# EasyEDA Pro project 电调.eprj

# Schematic Schematic1
Board Name: Board1; Create Date: 2025-06-07; Page Name: P1; Project Name: 电调单通道; Schematic Name: Schematic1; Update Date: 2025-06-07; Company: 嘉立创EDA; Page Size: A4; Version: V1.0
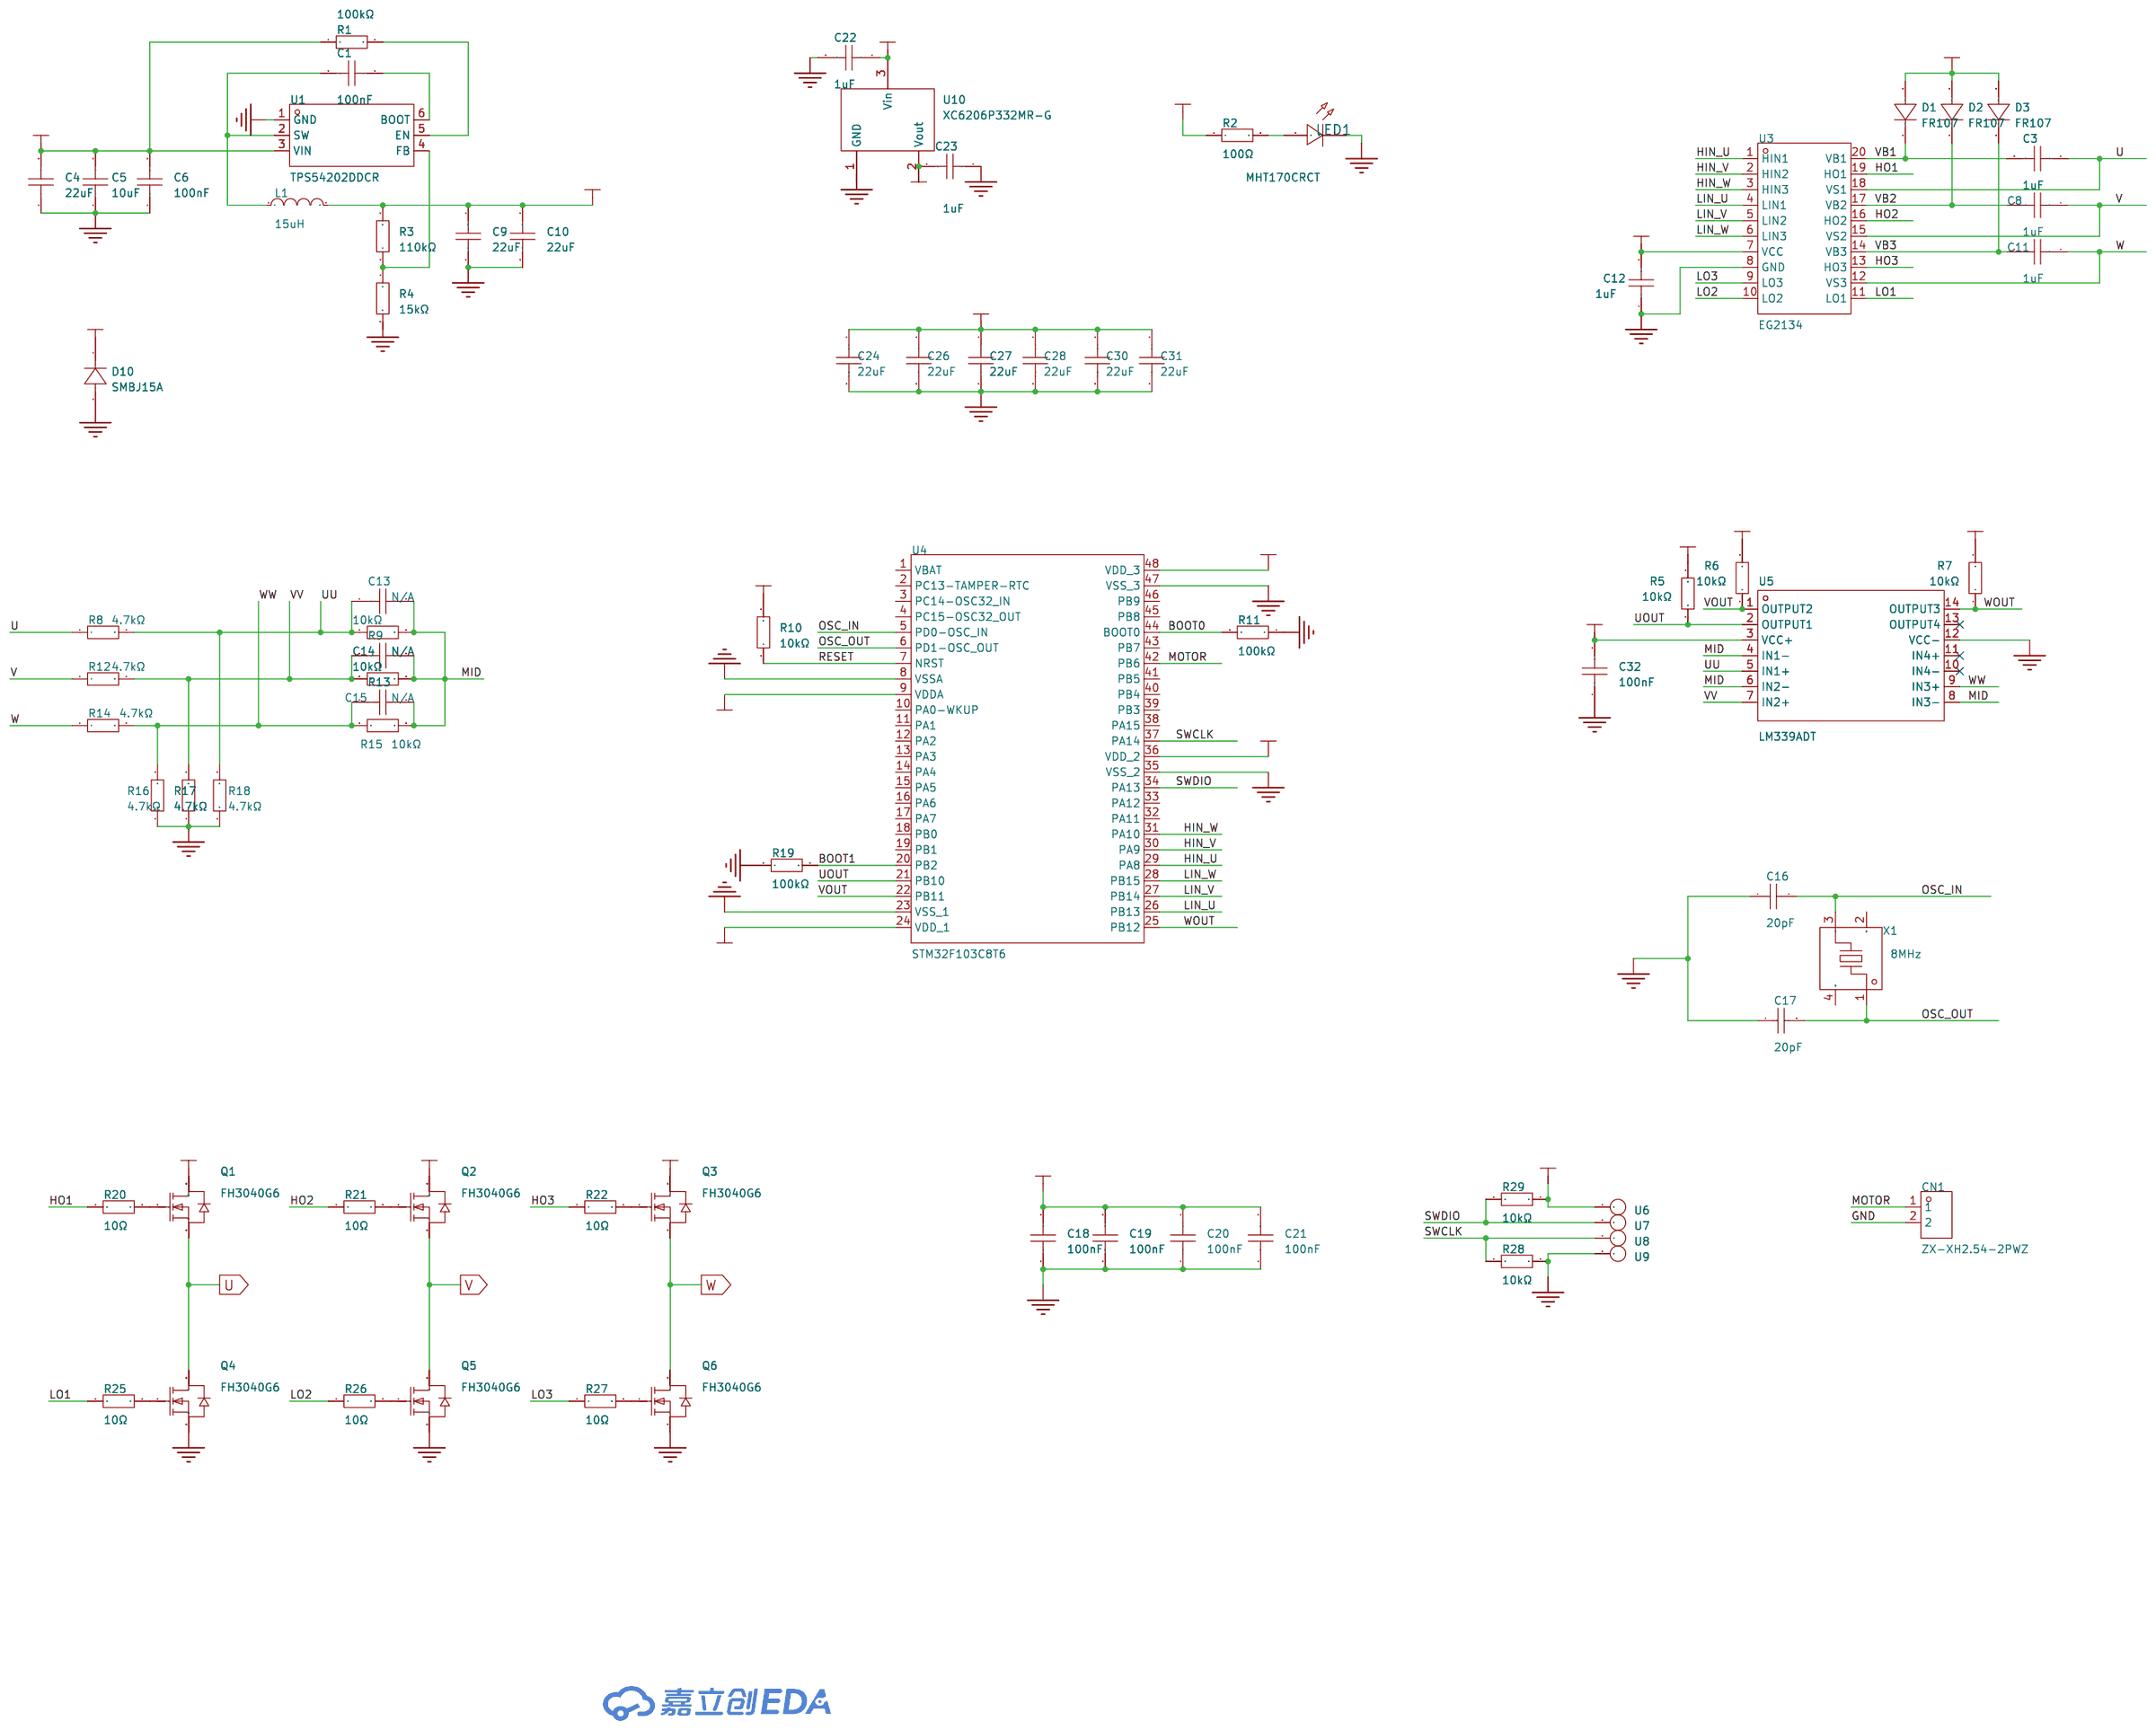
[diagram p0: schematic sheet]

## Parts
C1  100nF  [C0603]
C3  1uF  [C0603]
C4  22uF  [C0805]
C5  10uF  [C0805]
C6  100nF  [C0603]
C8  1uF  [C0603]
C9  22uF  [C0805]
C10  22uF  [C0805]
C11  1uF  [C0603]
C12  1uF  [C0603]
C13  N/A  [C0603]
C14  N/A  [C0603]
C15  N/A  [C0603]
C16  20pF  [C0603]
C17  20pF  [C0603]
C18  100nF  [C0603]
C19  100nF  [C0603]
C20  100nF  [C0603]
C21  100nF  [C0603]
C22  1uF  [C0603]
C23  1uF  [C0603]
C24  22uF  [C0805]
C26  22uF  [C0805]
C27  22uF  [C0805]
C28  22uF  [C0805]
C30  22uF  [C0805]
C31  22uF  [C0805]
C32  100nF  [C0603]
CN1  ZX-XH2.54-2PWZ  [CONN-TH_2P-P2.50_ZX-XH2.54-2PWZ]
D1  FR107  [SOD-123FL_L2.7-W1.8-LS3.8-RD]
D2  FR107  [SOD-123FL_L2.7-W1.8-LS3.8-RD]
D3  FR107  [SOD-123FL_L2.7-W1.8-LS3.8-RD]
D10  SMBJ15A  [SMB_L4.3-W3.6-LS5.3-RD]
L1  15uH  [IND-SMD_L7.0-W6.6_FXL0630]
LED1  MHT170CRCT  [LED0805-RD]
Q1  FH3040G6  [DFN-8_L3.3-W3.0-P0.65-LS3.3-BL-EP]
Q2  FH3040G6  [DFN-8_L3.3-W3.0-P0.65-LS3.3-BL-EP]
Q3  FH3040G6  [DFN-8_L3.3-W3.0-P0.65-LS3.3-BL-EP]
Q4  FH3040G6  [DFN-8_L3.3-W3.0-P0.65-LS3.3-BL-EP]
Q5  FH3040G6  [DFN-8_L3.3-W3.0-P0.65-LS3.3-BL-EP]
Q6  FH3040G6  [DFN-8_L3.3-W3.0-P0.65-LS3.3-BL-EP]
R1  100kΩ  [R0603]
R2  100Ω  [R0603]
R3  110kΩ  [R0603]
R4  15kΩ  [R0603]
R5  10kΩ  [R0603]
R6  10kΩ  [R0603]
R7  10kΩ  [R0603]
R8  4.7kΩ  [R0603]
R9  10kΩ  [R0603]
R10  10kΩ  [R0603]
R11  100kΩ  [R0603]
R12  4.7kΩ  [R0603]
R13  10kΩ  [R0603]
R14  4.7kΩ  [R0603]
R15  10kΩ  [R0603]
R16  4.7kΩ  [R0603]
R17  4.7kΩ  [R0603]
R18  4.7kΩ  [R0603]
R19  100kΩ  [R0603]
R20  10Ω  [R0603]
R21  10Ω  [R0603]
R22  10Ω  [R0603]
R25  10Ω  [R0603]
R26  10Ω  [R0603]
R27  10Ω  [R0603]
R28  10kΩ  [R0603]
R29  10kΩ  [R0603]
U1  TPS54202DDCR  [SOT-23-6_L2.9-W1.6-P0.95-LS2.8-BL]
U3  EG2134  [TSSOP-20_L6.5-W4.4-P0.65-LS6.4-BL]
U4  STM32F103C8T6  [LQFP-48_L7.0-W7.0-P0.50-LS9.0-BL]
U5  LM339ADT  [SOIC-14_L8.7-W3.9-P1.27-LS6.0-BL]
U6  -  [触点]
U7  -  [触点]
U8  -  [触点]
U9  -  [触点]
U10  XC6206P332MR-G  [SOT-23-3_L2.9-W1.6-P1.90-LS2.8-BR]
X1  8MHz  [CRYSTAL-SMD_4P-L3.2-W2.5-BL]

## Library data of the parts
C1 C6 C18-C21 C32 = CGA0603X7R104K500JT: 容值:100nF;精度:±10%;额定电压:50V;温度系数:X7R;; LCSC Part Name: 100nF ±10% 50V; Supplier Part: C6119867; Manufacturer: HRE(芯声); Supplier Footprint: 0603; JLCPCB Part Class: Extended Part; Datasheet: https://atta.szlcsc.com/upload/public/pdf/source/20250103/C44077DA9E7B3EFAE02F22B6D3D1CBC9.pdf; Supplier: LCSC; Tolerance: ±10%; Voltage Rating: 50V; Temperature Coefficient: X7R
C3 C8 C11 C12 C22 C23 = CL10A105KB8NNNC: 容值:1uF;精度:±10%;额定电压:50V;材质(温度系数):X5R;; LCSC Part Name: 1uF ±10% 50V; Supplier Part: C15849; Manufacturer: SAMSUNG(三星); Supplier Footprint: 0603; JLCPCB Part Class: 基础库; Datasheet: https://atta.szlcsc.com/upload/public/pdf/source/20160218/1457707763339.pdf; Supplier: LCSC; Tolerance: ±10%; Voltage Rated: 50V; Temperature Coefficient: X5R
C4 C9 C10 C24 C26-C28 C30 C31 = CL21A226MAYNNNE: 容值:22uF;精度:±20%;额定电压:25V;材质(温度系数):X5R;; LCSC Part Name: 22uF ±20% 25V; Supplier Part: C602037; Manufacturer: SAMSUNG(三星); Supplier Footprint: 0805; JLCPCB Part Class: 扩展库; Datasheet: https://atta.szlcsc.com/upload/public/pdf/source/20200609/C602037_1A0D619693E608A1BF6E80154254E2DB.pdf; Supplier: LCSC; Tolerance: ±20%; Voltage Rated: 25V; Temperature Coefficient: X5R
C5 = CL21A106KAYNNNE_C15850: 容值:10uF;精度:±10%;额定电压:25V;材质(温度系数):X5R;; LCSC Part Name: 10uF ±10% 25V; Supplier Part: C15850; Manufacturer: SAMSUNG(三星); Manufacturer Part: CL21A106KAYNNNE; Supplier Footprint: 0805; JLCPCB Part Class: 基础库; Datasheet: https://atta.szlcsc.com/upload/public/pdf/source/20160218/1457707763339.pdf; Supplier: LCSC; Tolerance: ±10%; Voltage Rated: 25V; Temperature Coefficient: X5R
C13-C15 = CAP_0603: Supplier Footprint: 0603
C16 C17 = CC0603JRNPO9BN200: 容值:20pF;精度:±5%;额定电压:50V;材质(温度系数):NP0;; LCSC Part Name: 20pF ±5% 50V; Supplier Part: C105621; Manufacturer: YAGEO(国巨); Supplier Footprint: 0603; JLCPCB Part Class: 扩展库; Datasheet: https://atta.szlcsc.com/upload/public/pdf/source/20170505/1493957838062.pdf; Supplier: LCSC; Tolerance: ±5%; Voltage Rated: 50V; Temperature Coefficient: NP0
CN1 = ZX-XH2.54-2PWZ: 插针结构:1x2P;间距:2.5mm;安装方式:弯插;参考系列:XH;总PIN数:2P;排数:1;每排PIN数:2;行距:-;额定电流:3A;触头材质:黄铜;触头镀层:锡;工作温度范围:-25℃~+85℃;; LCSC Part Name: 1x2P 间距:2.5mm 弯插 系列:XH; Supplier Part: C7429641; Manufacturer: Megastar(兆星); Supplier Footprint: 弯插,P=2.5mm; JLCPCB Part Class: 扩展库; Datasheet: https://atta.szlcsc.com/upload/public/pdf/source/20230619/56AE8F2E01CDFEAA97FC89B5ED558AB5.pdf; Supplier: LCSC; Pins Structure: 1x2P; Pitch: 2.5mm; Mounting Type: 弯插; Reference Series: XH; Number of Pins: 2P; Number of Rows: 1; Number of PINs Per Row: 2; Rated Current: 3A; Contact Material: 黄铜; Contact Plating: 锡; Operating Temperature: -25℃~+85℃; Rated Voltage (Max): 250V; Plastic Material: PA66; Flame Retardant Rating: UL94V-0; Color: 白色; Z-Height of the Board: 5.9mm; X-Length of Bottom Edge on Board (Spacing Line): 7.5mm; Y-Width of Bottom Edge on Board: 7.32mm
D1-D3 = FR107_C2760867: 二极管配置:独立式;正向压降(Vf):1.3V@1A;直流反向耐压(Vr):1kV;整流电流:1A;反向恢复时间(trr):500ns;; Supplier Part: C2760867; Manufacturer: Slkor(萨科微); Supplier Footprint: SOD-123FL; JLCPCB Part Class: 扩展库; Datasheet: https://atta.szlcsc.com/upload/public/pdf/source/20210316/C2760867_0B45AFF5F62837EEEC945A80EBBE02AA.pdf; Supplier: LCSC; Diode Configuration: 独立式; Forward Voltage (Vf@If): 1.3V@1A; Reverse Voltage (Vr): 1kV; Rectified Current: 1A; Reverse Leakage Current (Ir): 5uA@1kV; Reverse Recovery Time (trr): 500ns; Operating Temperature: -55℃~+150℃@(Tj)
D10 = SMBJ15A_C19077569: 极性:单向;反向截止电压(Vrwm):15V;钳位电压:24.4V;峰值脉冲电流(Ipp):24.59A;峰值脉冲功率(Ppp):600W;击穿电压:18.5V;; Supplier Part: C19077569; Manufacturer: 宏嘉诚; Supplier Footprint: SMB; JLCPCB Part Class: 扩展库; Datasheet: https://atta.szlcsc.com/upload/public/pdf/source/20250107/474F05451FC8AB27D7FA0238914F96F6.pdf; Supplier: LCSC; Polarity: 单向; Reverse Stand-Off Voltage (Vrwm): 15V; Clamping Voltage: 24.4V; Peak Pulse Current (Ipp): 24.59A; Peak Pulse Power Dissipation (Ppp): 600W; Voltage - Breakdown: 18.5V; Reverse Leakage Current (Ir): 5uA; Type: TVS
L1 = FXL0630-150-M: 电感值:15uH;精度:±20%;额定电流:3A;饱和电流(Isat):4.5A;类型:一体成型电感;; LCSC Part Name: 15uH ±20% 4.5A; Supplier Part: C177243; Manufacturer: cjiang(长江微电); Supplier Footprint: SMD,6.6x7mm; JLCPCB Part Class: 扩展库; Datasheet: https://atta.szlcsc.com/upload/public/pdf/source/20240426/3189EA8206330E2108542F9E34E540E7.pdf; Supplier: LCSC; Tolerance: ±20%; Rated Current: 3A; Saturation Current (Isat): 4.5A; DC Resistance (DCR): 115mΩ; Type: 一体成型电感
LED1 = MHT170CRCT: 发光颜色:红色;功率:60mW；40mW;正向电流:20mA;主波长:617.5nm~633.5nm;二极管配置:-;透镜颜色:无色透明透镜;色温:-;发光角度:140°;载带方式:-;工作温度:-40℃~+85℃;; LCSC Part Name: 红灯; Supplier Part: C389523; Manufacturer: MEIHUA(美华); Supplier Footprint: 0805; JLCPCB Part Class: Extended Part; Datasheet: https://atta.szlcsc.com/upload/public/pdf/source/20190515/C389523_83CDF1F865E0603B87BA4637FE3B16EE.pdf; Supplier: LCSC; Emitted Color: 红色; Power Dissipation: 60mW；40mW; Forward Current: 20mA; Dominant Wavelength: 617.5nm~633.5nm; Peak Wavelength: 632nm; Lens Color: 无色透明透镜; Viewing Angle: 140°; Operating Temperature: -40℃~+85℃
Q1-Q6 = FH3040G6: 类型:1个N沟道;漏源电压(Vdss):30V;连续漏极电流(Id):40A;导通电阻(RDS(on)):-;耗散功率(Pd):35W;阈值电压(Vgs(th)):1.6V;; LCSC Part Name: N沟道增强型功率MOSFET,电流:40A,耐压:30V; Supplier Part: C2929017; Manufacturer: 鑫飞宏; Supplier Footprint: DFN-8-EP(3.3x3.3); JLCPCB Part Class: 扩展库; Datasheet: https://atta.szlcsc.com/upload/public/pdf/source/20211207/E98152BD916620F113CB2D51F2AAD46A.pdf; Supplier: LCSC; Type: 1个N沟道; Drain to Source Voltage: 30V; Current - Continuous Drain(Id): 40A; Pd - Power Dissipation: 35W; Gate Threshold Voltage (Vgs(th)@Id): 1.6V; Gate Charge(Qg): 45nC@10V; Input Capacitance(Ciss@Vds): 2.33nF@15V; Reverse Transfer Capacitance (Crss@Vds): 230pF@15V; Operating Temperature: -55℃~+150℃
R1 R11 R19 = RT0603BRD07100KL: 电阻类型:薄膜电阻;阻值:100kΩ;精度:±0.1%;功率:100mW;最大工作电压:75V;温度系数:±25ppm/℃;; LCSC Part Name: 薄膜电阻 100kΩ ±0.1% 100mW; Supplier Part: C122538; Manufacturer: YAGEO(国巨); Supplier Footprint: 0603; JLCPCB Part Class: Extended Part; Datasheet: https://atta.szlcsc.com/upload/public/pdf/source/20170721/C122538_1500619326323834092.pdf; Supplier: LCSC; Type: 薄膜电阻; Tolerance: ±0.1%; Power(Watts): 100mW; Overload Voltage (Max): 75V; Temperature Coefficient: ±25ppm/℃; Operating Temperature Range: -55℃~+155℃
R2 = RC0603FR-07100RL: 电阻类型:厚膜电阻;阻值:100Ω;精度:±1%;功率:100mW;最大工作电压:75V;温度系数:±100ppm/℃;; LCSC Part Name: 厚膜电阻 100Ω ±1% 100mW; Supplier Part: C105588; Manufacturer: YAGEO(国巨); Supplier Footprint: 0603; JLCPCB Part Class: Extended Part; Datasheet: https://atta.szlcsc.com/upload/public/pdf/source/20180316/70C0E2BDAE7FCC62C531A5A58D202EE1.pdf; Supplier: LCSC; Type: 厚膜电阻; Tolerance: ±1%; Power(Watts): 100mW; Overload Voltage (Max): 75V; Temperature Coefficient: ±100ppm/℃; Operating Temperature Range: -55℃~+155℃
R3 = RC0603FR-07110KL: 电阻类型:厚膜电阻;阻值:110kΩ;精度:±1%;功率:100mW;最大工作电压:75V;温度系数:±100ppm/℃;; LCSC Part Name: 厚膜电阻 110kΩ ±1% 100mW; Supplier Part: C137807; Manufacturer: YAGEO(国巨); Supplier Footprint: 0603; JLCPCB Part Class: 扩展库; Datasheet: https://atta.szlcsc.com/upload/public/pdf/source/20180821/C275644_0D56F95EFF785E7D9A1FEF436B37DA78.pdf; Supplier: LCSC; Type: 厚膜电阻; Tolerance: ±1%; Power(Watts): 100mW; Overload Voltage (Max): 75V; Temperature Coefficient: ±100ppm/℃; Operating Temperature Range: -55℃~+155℃
R4 = RC0603FR-0715KL: 电阻类型:厚膜电阻;阻值:15kΩ;精度:±1%;功率:100mW;最大工作电压:75V;温度系数:±100ppm/℃;; LCSC Part Name: 厚膜电阻 15kΩ ±1% 100mW; Supplier Part: C114661; Manufacturer: YAGEO(国巨); Supplier Footprint: 0603; JLCPCB Part Class: 扩展库; Datasheet: https://atta.szlcsc.com/upload/public/pdf/source/20180821/C275644_0D56F95EFF785E7D9A1FEF436B37DA78.pdf; Supplier: LCSC; Type: 厚膜电阻; Tolerance: ±1%; Power(Watts): 100mW; Overload Voltage (Max): 75V; Temperature Coefficient: ±100ppm/℃; Operating Temperature Range: -55℃~+155℃
R5-R7 R9 R10 R13 R15 R28 R29 = 0603WAF1002T5E: 电阻类型:厚膜电阻;阻值:10kΩ;精度:±1%;功率:100mW;最大工作电压:75V;温度系数:±100ppm/℃;; LCSC Part Name: 厚膜电阻 10kΩ ±1% 100mW; Supplier Part: C25804; Manufacturer: UNI-ROYAL(厚声); Supplier Footprint: 0603; JLCPCB Part Class: Basic Part; Datasheet: https://atta.szlcsc.com/upload/public/pdf/source/20200306/C422600_1E6D84923E4A46A82E41ADD87F860B5C.pdf; Supplier: LCSC; Type: 厚膜电阻; Tolerance: ±1%; Power(Watts): 100mW; Overload Voltage (Max): 75V; Temperature Coefficient: ±100ppm/℃; Operating Temperature Range: -55℃~+155℃
R8 R12 R14 R16-R18 = 0603WAF4701T5E: 电阻类型:厚膜电阻;阻值:4.7kΩ;精度:±1%;功率:100mW;最大工作电压:75V;温度系数:±100ppm/℃;; LCSC Part Name: 4.7kΩ ±1% 100mW 厚膜电阻; Supplier Part: C23162; Manufacturer: UNI-ROYAL(厚声); Supplier Footprint: 0603; JLCPCB Part Class: Basic Part; Datasheet: https://atta.szlcsc.com/upload/public/pdf/source/20200306/C422600_1E6D84923E4A46A82E41ADD87F860B5C.pdf; Supplier: LCSC; Type: 厚膜电阻; Tolerance: ±1%; Power(Watts): 100mW; Overload Voltage (Max): 75V; Temperature Coefficient: ±100ppm/℃; Operating Temperature Range: -55℃~+155℃
R20-R22 R25-R27 = RC0603FR-0710RL: 电阻类型:厚膜电阻;阻值:10Ω;精度:±1%;功率:100mW;最大工作电压:75V;温度系数:±200ppm/℃;; LCSC Part Name: 厚膜电阻 10Ω ±1% 100mW; Supplier Part: C109318; Manufacturer: YAGEO(国巨); Supplier Footprint: 0603; JLCPCB Part Class: Extended Part; Datasheet: https://atta.szlcsc.com/upload/public/pdf/source/20180316/70C0E2BDAE7FCC62C531A5A58D202EE1.pdf; Supplier: LCSC; Type: 厚膜电阻; Tolerance: ±1%; Power(Watts): 100mW; Overload Voltage (Max): 75V; Temperature Coefficient: ±200ppm/℃; Operating Temperature Range: -55℃~+155℃
U1 = TPS54202DDCR: 功能类型:降压型;输出类型:可调;工作电压:4.5V~28V;输出电压:-;输出电流:2A;; LCSC Part Name: 4.5V至28V输入、2A输出、低EMI同步降压转换器; Supplier Part: C191884; Manufacturer: TI(德州仪器); Supplier Footprint: SOT-23-6; JLCPCB Part Class: 扩展库; Datasheet: https://www.ti.com/cn/lit/gpn/tps54202; Supplier: LCSC; Function: 降压型; Output Type: 可调; Input Voltage: 4.5V~28V; Output Current: 2A; Switching Frequency: 500kHz; Operating Temperature: -40℃~+125℃; Synchronous Rectification: 是; Number of Outputs: 1; Topology: 降压式; Quiescent Current (Iq): 45uA; Switch tube (built-in/external): 内置
U3 = EG2134: Supplier Part: C480661; Manufacturer: EG(屹晶微); Supplier Footprint: TSSOP-20; JLCPCB Part Class: 扩展库; Datasheet: https://atta.szlcsc.com/upload/public/pdf/source/20200107/C480661_235F21EC73D073F149882C12A613FF28.pdf; Supplier: LCSC
U4 = STM32F103C8T6: CPU内核:ARM-M3;CPU最大主频:72MHz;应用领域:-;; LCSC Part Name: 主流增强型ARM Cortex-M3 MCU，具有64 KB Flash、72 MHz CPU、电机控制、USB和CAN; Supplier Part: C8734; Manufacturer: ST(意法半导体); Supplier Footprint: LQFP-48(7x7); JLCPCB Part Class: 扩展库; Datasheet: https://atta.szlcsc.com/upload/public/pdf/source/20220812/8363ACEC51AD55ECEB84799464F7CB85.pdf; Supplier: LCSC; CPU Core: ARM-M3; CPU Maximum Speed: 72MHz; Program Storage Size: 64KB; Program Memory Type: FLASH; Number of I/O: 37; ADC (Bit): 12bit; Low Voltage Detection Threshold: 2V~3.6V; Check: true
U5 = LM339ADT: 输入失调电压(Vos):2mV;输入偏置电流(Ib):100nA;; LCSC Part Name: 低功耗四通道电压比较器; Supplier Part: C89046; Manufacturer: ST(意法半导体); Supplier Footprint: SOIC-14; JLCPCB Part Class: 扩展库; Datasheet: https://atta.szlcsc.com/upload/public/pdf/source/20181030/C283323_01965803D03C52B8D5D374D61EEFE444.pdf; Supplier: LCSC; Input Offset Voltage (Vos): 2mV; Input Bias Current (Ib): 100nA; Supply Voltage: 2V~32V；1V~16V; Output Type: 开集; Output Mode: MOS；DTL；TTL；CMOS；ECL; Supply Current: 2.5mA; Operating Temperature: 0℃~+70℃
U6-U9 = 触点
U10 = XC6206P332MR-G_C5446: 输出类型:固定;最大输入电压:6V;输出电压:3.3V;最大输出电流:200mA;电源纹波抑制比(PSRR):-;输出极性:正极;; LCSC Part Name: 输入6V 输出3.3V 200mA; Supplier Part: C5446; Manufacturer: TOREX(特瑞仕); Supplier Footprint: SOT-23-3L; JLCPCB Part Class: 基础库; Datasheet: https://atta.szlcsc.com/upload/public/pdf/source/20130823/1457706639850.pdf; Supplier: LCSC; Output Type: 固定; Maximum Input Voltage: 6V; Output Voltage: 3.3V; MAX Output Current: 200mA; Dropout Voltage: 680mV@(100mA); Output Polarity: 正极; Number of Outputs: 1
X1 = X32258MSB4SI: 晶振类型:贴片晶振;频率:8MHz;常温频差:±10ppm;负载电容:20pF;频率稳定度:±20ppm;; LCSC Part Name: 8MHz ±10ppm 20pF; Supplier Part: C2682774; Manufacturer: YXC(扬兴晶振); Supplier Footprint: SMD3225-4P; JLCPCB Part Class: 扩展库; Datasheet: https://atta.szlcsc.com/upload/public/pdf/source/20240329/19D5F850207469550BEB00D7DFEDBC7A.pdf; Supplier: LCSC; Type: 贴片晶振; Normal temperature Frequency Tolerance: ±10ppm; Load Capacitance: 20pF; Frequency Stability: ±20ppm; Operating Temperature: -40℃~+85℃

## Nets
GND: C4.1 C5.1 C6.1 C9.2 C10.2 C12.1 C16.1 C17.1 C18.1 C19.1 C20.1 C21.1 C22.2 C23.1 C24.2 C26.2 C27.2 C28.2 C30.2 C31.2 C32.1 CN1.2 D10.2(A) LED1.1(C) Q4.1(S) Q4.2(S) Q4.3(S) Q5.1(S) Q5.2(S) Q5.3(S) Q6.1(S) Q6.2(S) Q6.3(S) R4.2 R11.1 R16.1 R17.1 R18.1 R19.1 R28.1 U1.1(GND) U3.8(GND) U4.8(VSSA) U4.23(VSS_1) U4.35(VSS_2) U4.47(VSS_3) U5.12(VCC-) U9.1 U10.1(GND)
VCC3V3: C18.2 C19.2 C20.2 C21.2 C23.2 R2.1 R5.2 R6.2 R7.2 R10.2 R29.1 U4.9(VDDA) U4.24(VDD_1) U4.36(VDD_2) U4.48(VDD_3) U6.1 U10.2(Vout)
VCC5V: C9.1 C10.1 C22.1 L1.2 R3.2 U10.3(Vin)
VCC12V: C4.2 C5.2 C6.2 C12.2 C24.1 C26.1 C27.1 C28.1 C30.1 C31.1 C32.2 D1.2(A) D2.2(A) D3.2(A) D10.1(K) Q1.5(D) Q1.6(D) Q1.7(D) Q1.8(D) Q2.5(D) Q2.6(D) Q2.7(D) Q2.8(D) Q3.5(D) Q3.6(D) Q3.7(D) Q3.8(D) R1.1 U1.3(VIN) U3.7(VCC) U5.3(VCC+)
BOOT0: R11.2 U4.44(BOOT0)
BOOT1: R19.2 U4.20(PB2)
HIN_U: U3.1(HIN1) U4.29(PA8)
HIN_V: U3.2(HIN2) U4.30(PA9)
HIN_W: U3.3(HIN3) U4.31(PA10)
HO1: R20.1 U3.19(HO1)
HO2: R21.1 U3.16(HO2)
HO3: R22.1 U3.13(HO3)
LIN_U: U3.4(LIN1) U4.26(PB13)
LIN_V: U3.5(LIN2) U4.27(PB14)
LIN_W: U3.6(LIN3) U4.28(PB15)
LO1: R25.1 U3.11(LO1)
LO2: R26.1 U3.10(LO2)
LO3: R27.1 U3.9(LO3)
MID: C13.2 C14.2 C15.2 R9.2 R13.2 R15.2 U5.4(IN1-) U5.6(IN2-) U5.8(IN3-)
MOTOR: CN1.1 U4.42(PB6)
OSC_IN: C16.2 U4.5(PD0-OSC_IN) X1.3
OSC_OUT: C17.2 U4.6(PD1-OSC_OUT) X1.1
RESET: R10.1 U4.7(NRST)
SWCLK: R28.2 U4.37(PA14) U8.1
SWDIO: R29.2 U4.34(PA13) U7.1
U: C3.1 Q1.1(S) Q1.2(S) Q1.3(S) Q4.5(D) Q4.6(D) Q4.7(D) Q4.8(D) R8.1 U3.18(VS1)
UOUT: R5.1 U4.21(PB10) U5.2(OUTPUT1)
UU: C13.1 R8.2 R9.1 R18.2 U5.5(IN1+)
V: C8.1 Q2.1(S) Q2.2(S) Q2.3(S) Q5.5(D) Q5.6(D) Q5.7(D) Q5.8(D) R12.1 U3.15(VS2)
VB1: C3.2 D1.1(K) U3.20(VB1)
VB2: C8.2 D2.1(K) U3.17(VB2)
VB3: C11.2 D3.1(K) U3.14(VB3)
VOUT: R6.1 U4.22(PB11) U5.1(OUTPUT2)
VV: C14.1 R12.2 R13.1 R17.2 U5.7(IN2+)
W: C11.1 Q3.1(S) Q3.2(S) Q3.3(S) Q6.5(D) Q6.6(D) Q6.7(D) Q6.8(D) R14.1 U3.12(VS3)
WOUT: R7.1 U4.25(PB12) U5.14(OUTPUT3)
WW: C15.1 R14.2 R15.1 R16.2 U5.9(IN3+)
$1N830: LED1.2(A) R2.2
$1N838: R1.2 U1.5(EN)
$1N841: C1.1 U1.6(BOOT)
$1N842: C1.2 L1.1 U1.2(SW)
$1N843: R3.1 R4.1 U1.4(FB)
$1N6581: Q1.4(G) R20.2
$1N6585: Q2.4(G) R21.2
$1N6698: Q3.4(G) R22.2
$1N6700: Q5.4(G) R26.2
$1N6702: Q6.4(G) R27.2
$1N6741: Q4.4(G) R25.2

Not connected (* = marked no-connect by the designer): U4 1(VBAT) 2(PC13-TAMPER-RTC) 3(PC14-OSC32_IN) 4(PC15-OSC32_OUT) 10(PA0-WKUP) 11(PA1) 12(PA2) 13(PA3) 14(PA4) 15(PA5) 16(PA6) 17(PA7) 18(PB0) 19(PB1) 32(PA11) 33(PA12) 38(PA15) 39(PB3) 40(PB4) 41(PB5) 43(PB7) 45(PB8) 46(PB9); U5 10(IN4-)* 11(IN4+)* 13(OUTPUT4)*; X1 2(GND) 4(GND)

# Board PCB1
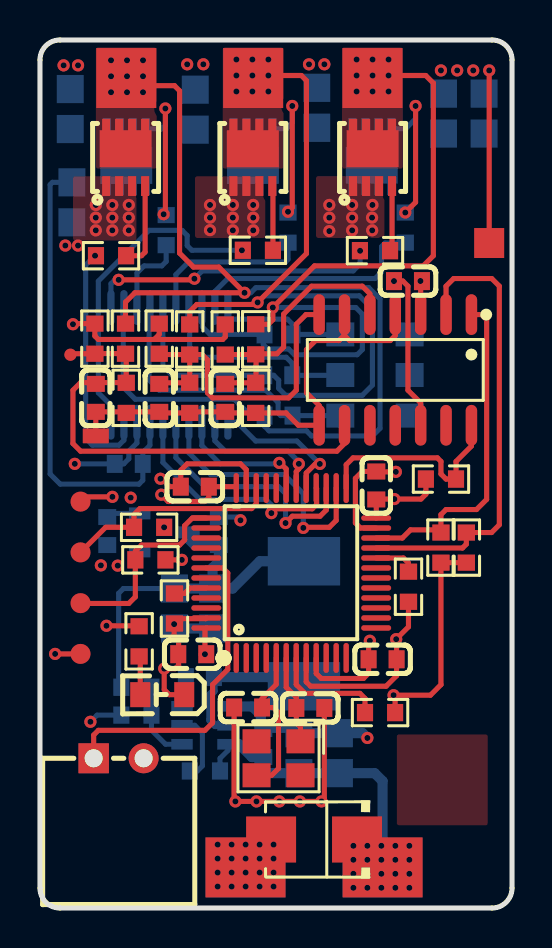
[diagram p1: board, top side]
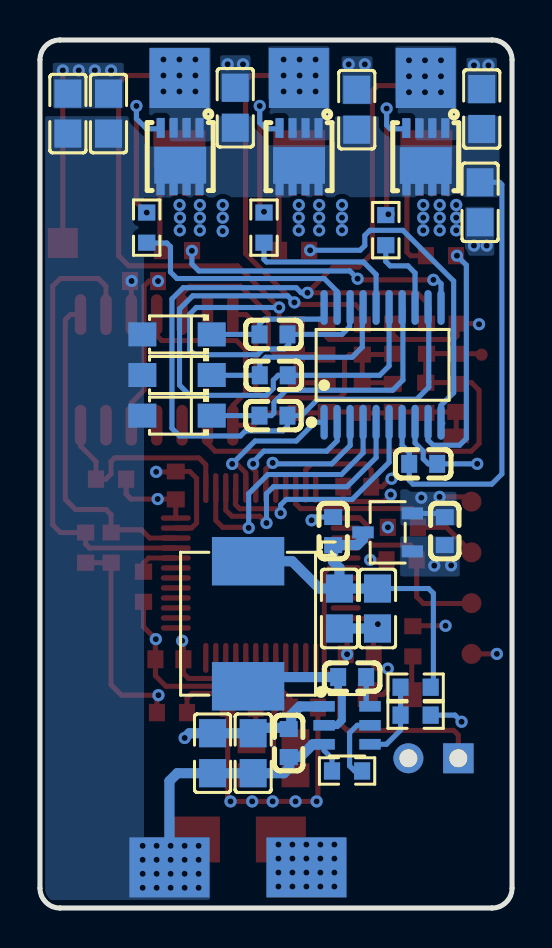
[diagram p2: board, bottom side, seen from below]

Outline 23.62 x 43.43 mm; copper layers: Top Layer, Inner1, Inner2, Bottom Layer. Coordinates in mm from the lower left corner of the outline.
Outline path: 0,42.43 0,1 arc(0.29,0.29) 1,0 22.62,0 arc(23.33,0.29) 23.62,1 23.62,42.43 arc(23.33,43.14) 22.62,43.43 1,43.43 arc(0.29,43.14) 0,42.43
Stack: Top Layer 0.035mm 外层铜厚1oz / Dielectric1 0.2104mm 7628 RC49% 8.6mil / Inner1 0.0152mm 内层铜厚 / Dielectric2 1.065mm 1.1mm H/HOZ Copper / Inner2 0.0152mm 内层铜厚 / Dielectric3 0.2104mm 7628 RC49% 8.6mil / Bottom Layer 0.035mm 外层铜厚1oz

## Design rules (mm)
template: 自定义配置
spacing copperThickness1oz (default): track to track 0.102, other pairs 0.152 to 0.3
spacing copperThickness2oz: track to track 0.203, other pairs 0.152 to 0.3
track width copperThickness1oz (default): min 0.127, default 0.254, max 2.54
track width copperThickness2oz: min 0.203, default 0.254, max 2.54
differential pair differentialPair (default): width min 0.127, default 0.254, max 2.54; gap min 0.152, default 0.152
via viaSize (default): diameter min 0.5, default 0.61, max 10; hole min 0.3, default 0.305, max 6.3

## Placement (name value [footprint] x y rotation side)
C1  100nF  [C0603]  8 11.56 0 bottom
C3  1uF  [C0603]  11.94 28.7 0 bottom
C4  22uF  [C0805]  14.99 7.75 270 bottom
C5  10uF  [C0805]  12.95 7.75 270 bottom
C6  100nF  [C0603]  11.18 8.25 270 bottom
C8  1uF  [C0603]  11.92 26.66 0 bottom
C9  22uF  [C0805]  6.73 14.99 270 bottom
C10  22uF  [C0805]  8.64 14.99 270 bottom
C11  1uF  [C0603]  11.94 24.64 0 bottom
C12  1uF  [C0603]  4.44 22.22 0 bottom
C13  N/A  [C0603]  9.27 25.53 270 top
C14  N/A  [C0603]  5.97 25.53 270 top
C15  N/A  [C0603]  2.79 25.53 270 top
C16  20pF  [C0603]  10.41 10.03 0 top
C17  20pF  [C0603]  13.53 10.01 180 top
C18  100nF  [C0603]  7.62 12.7 0 top
C19  100nF  [C0603]  16.83 21.14 270 top
C20  100nF  [C0603]  17.14 12.45 180 top
C21  100nF  [C0603]  7.75 21.08 0 top
C22  1uF  [C0603]  8.95 18.86 90 bottom
C23  1uF  [C0603]  3.36 18.86 90 bottom
C24  22uF  [C0805]  13.85 40.04 90 bottom
C26  22uF  [C0805]  7.77 39.95 90 bottom
C27  22uF  [C0805]  1.6 35.31 270 bottom
C28  22uF  [C0805]  20.19 39.75 90 bottom
C30  22uF  [C0805]  22.22 39.75 90 bottom
C31  22uF  [C0805]  1.52 39.98 90 bottom
C32  100nF  [C0603]  18.41 31.37 0 top
CN1  ZX-XH2.54-2PWZ  [CONN-TH_2P-P2.50_ZX-XH2.54-2PWZ]  3.94 7.49 0 top
D1  FR107  [SOD-123FL_L2.7-W1.8-LS3.8-RD]  16.76 28.7 0 bottom
D2  FR107  [SOD-123FL_L2.7-W1.8-LS3.8-RD]  16.76 26.67 0 bottom
D3  FR107  [SOD-123FL_L2.7-W1.8-LS3.8-RD]  16.76 24.64 0 bottom
D10  SMBJ15A  [SMB_L4.3-W3.6-LS5.3-RD]  13.72 3.43 180 top
L1  15uH  [IND-SMD_L7.0-W6.6_FXL0630]  13.21 14.22 270 bottom
LED1  MHT170CRCT  [LED0805-RD]  6.12 10.68 180 top
NOREF  -  [Pad_e444]  10.67 41.53 0 top
NOREF#2  -  [Pad_e457]  10.67 41.53 0 top
NOREF#3  -  [Pad_e656]  1.52 27.69 0 top
NOREF#4  -  [Pad_e89]  10.29 2.03 0 top
NOREF#5  -  [Pad_e445]  16.64 41.53 0 top
NOREF#6  -  [Pad_e709]  2.79 23.62 0 top
NOREF#7  -  [Pad_e153]  10.29 2.03 0 top
NOREF#8  -  [Pad_e683]  22.48 33.27 0 top
NOREF#9  -  [Pad_e456]  16.64 41.53 0 top
NOREF#10  -  [Pad_e443]  4.32 41.53 0 top
NOREF#11  -  [Pad_e154]  17.14 2.03 0 top
NOREF#12  -  [Pad_e458]  4.32 41.53 0 top
NOREF#13  -  [Pad_e88]  17.14 2.03 0 top
Q1  FH3040G6  [DFN-8_L3.3-W3.0-P0.65-LS3.3-BL-EP]  16.6 37.6 0 bottom
Q2  FH3040G6  [DFN-8_L3.3-W3.0-P0.65-LS3.3-BL-EP]  10.66 37.59 0 bottom
Q3  FH3040G6  [DFN-8_L3.3-W3.0-P0.65-LS3.3-BL-EP]  4.32 37.59 0 bottom
Q4  FH3040G6  [DFN-8_L3.3-W3.0-P0.65-LS3.3-BL-EP]  16.64 37.56 0 top
Q5  FH3040G6  [DFN-8_L3.3-W3.0-P0.65-LS3.3-BL-EP]  10.65 37.56 0 top
Q6  FH3040G6  [DFN-8_L3.3-W3.0-P0.65-LS3.3-BL-EP]  4.29 37.56 0 top
R1  100kΩ  [R0603]  8.25 6.86 180 bottom
R2  100Ω  [R0603]  4.96 13.34 270 top
R3  110kΩ  [R0603]  4.83 11.05 180 bottom
R4  15kΩ  [R0603]  4.83 9.65 180 bottom
R5  10kΩ  [R0603]  21.34 18.03 270 top
R6  10kΩ  [R0603]  20.07 18.03 270 top
R7  10kΩ  [R0603]  20.07 21.46 180 top
R8  4.7kΩ  [R0603]  10.79 28.46 270 top
R9  10kΩ  [R0603]  10.79 25.53 270 top
R10  10kΩ  [R0603]  17.02 9.78 0 top
R11  100kΩ  [R0603]  6.73 14.99 90 top
R12  4.7kΩ  [R0603]  7.49 28.45 270 top
R13  10kΩ  [R0603]  7.49 25.53 270 top
R14  4.7kΩ  [R0603]  4.28 28.49 270 top
R15  10kΩ  [R0603]  4.32 25.53 270 top
R16  4.7kΩ  [R0603]  2.75 28.49 270 top
R17  4.7kΩ  [R0603]  5.97 28.49 270 top
R18  4.7kΩ  [R0603]  9.27 28.45 270 top
R19  100kΩ  [R0603]  18.44 16.08 90 top
R20  10Ω  [R0603]  18.28 34.04 90 bottom
R21  10Ω  [R0603]  12.41 34.04 90 bottom
R22  10Ω  [R0603]  6.32 33.92 90 bottom
R25  10Ω  [R0603]  16.76 32.89 0 top
R26  10Ω  [R0603]  10.9 32.91 0 top
R27  10Ω  [R0603]  3.56 32.64 0 top
R28  10kΩ  [R0603]  5.53 17.42 180 top
R29  10kΩ  [R0603]  5.46 19.05 180 top
U1  TPS54202DDCR  [SOT-23-6_L2.9-W1.6-P0.95-LS2.8-BL]  8.25 9.14 270 bottom
U3  EG2134  [TSSOP-20_L6.5-W4.4-P0.65-LS6.4-BL]  6.48 27.18 180 bottom
U4  STM32F103C8T6  [LQFP-48_L7.0-W7.0-P0.50-LS9.0-BL]  12.57 16.76 0 top
U5  LM339ADT  [SOIC-14_L8.7-W3.9-P1.27-LS6.0-BL]  17.78 26.92 180 top
U6  -  [触点]  2.03 20.33 0 top
U7  -  [触点]  2.03 17.79 0 top
U8  -  [触点]  2.03 15.25 0 top
U9  -  [触点]  2.03 12.71 0 top
U10  XC6206P332MR-G  [SOT-23-3_L2.9-W1.6-P1.90-LS2.8-BR]  6.22 18.8 180 bottom
X1  8MHz  [CRYSTAL-SMD_4P-L3.2-W2.5-BL]  11.94 7.49 180 top

## Footprints (pads in the part's own frame, mm; a bottom-side part is the same pattern mirrored in y, then rotated)
C0603
  rect 0.8x0.9 smd: 1(-0.7,0) 2(0.7,0)
C0805
  rect 1.41x1.35 smd: 1(-1,0) 2(1,0)
CONN-TH_2P-P2.50_ZX-XH2.54-2PWZ
  rect 1.524x1.5 hole 0.9: 1(-1.25,0)
  round 1.5 hole 0.9: 2(1.25,0)
CRYSTAL-SMD_4P-L3.2-W2.5-BL
  rect 1.4x1.2 smd: 1(-1.1,-0.85) 2(1.1,-0.85) 3(1.1,0.85) 4(-1.1,0.85)
DFN-8_L3.3-W3.0-P0.65-LS3.3-BL-EP
  rect 0.405x0.99 smd: 1(-0.975,-1.435) 2(-0.325,-1.435) 3(0.325,-1.435) 4(0.975,-1.435) 5(0.975,1.435) 6(0.325,1.435) 7(-0.325,1.435) 8(-0.975,1.435)
  rect 2.6x1.84 smd: 9(0,0.44)
IND-SMD_L7.0-W6.6_FXL0630
  rect 2.424x3.62 smd: 1(3.128,0) 2(-3.128,0)
LED0805-RD
  rect 1x1.25 smd: 1(-1.1,0) 2(1.1,0)
LQFP-48_L7.0-W7.0-P0.50-LS9.0-BL
  oval 0.27x1.5 smd: 1(-2.75,-4.25) 2(-2.25,-4.25) 3(-1.75,-4.25) 4(-1.25,-4.25) 5(-0.75,-4.25) 6(-0.25,-4.25) 7(0.25,-4.25) 8(0.75,-4.25) 9(1.25,-4.25) 10(1.75,-4.25) 11(2.25,-4.25) 12(2.75,-4.25) 25(2.75,4.25) 26(2.25,4.25) 27(1.75,4.25) 28(1.25,4.25) 29(0.75,4.25) 30(0.25,4.25) 31(-0.25,4.25) 32(-0.75,4.25) 33(-1.25,4.25) 34(-1.75,4.25) 35(-2.25,4.25) 36(-2.75,4.25)
  oval 1.5x0.27 smd: 13(4.25,-2.75) 14(4.25,-2.25) 15(4.25,-1.75) 16(4.25,-1.25) 17(4.25,-0.75) 18(4.25,-0.25) 19(4.25,0.25) 20(4.25,0.75) 21(4.25,1.25) 22(4.25,1.75) 23(4.25,2.25) 24(4.25,2.75) 37(-4.25,2.75) 38(-4.25,2.25) 39(-4.25,1.75) 40(-4.25,1.25) 41(-4.25,0.75) 42(-4.25,0.25) 43(-4.25,-0.25) 44(-4.25,-0.75) 45(-4.25,-1.25) 46(-4.25,-1.75) 47(-4.25,-2.25) 48(-4.25,-2.75)
Pad_e88
  rect 4x3 smd: 2(0,0)
Pad_e89
  rect 4x3 smd: 2(0,0)
Pad_e153
  rect 4x3 smd far side: 2(0,0)
Pad_e154
  rect 4x3 smd far side: 2(0,0)
Pad_e443
  rect 3x3 smd: 2(0,0)
Pad_e444
  rect 3x3 smd: 2(0,0)
Pad_e445
  rect 3x3 smd: 2(0,0)
Pad_e456
  rect 3x3 smd far side: 2(0,0)
Pad_e457
  rect 3x3 smd far side: 2(0,0)
Pad_e458
  rect 3x3 smd far side: 2(0,0)
Pad_e656
  round 0.61 smd: TP1(0,0)
Pad_e683
  rect 1.5x1.5 smd: 2(0,0)
Pad_e709
  rect 1.3x0.734 smd: 2(0,0)
R0603
  rect 0.806x0.864 smd: 1(-0.753,0) 2(0.753,0)
SMB_L4.3-W3.6-LS5.3-RD
  rect 2.5x2.3 smd: 1(-2.15,0) 2(2.15,0)
SOD-123FL_L2.7-W1.8-LS3.8-RD
  rect 1.4x1.2 smd: 1(-1.735,0) 2(1.735,0)
SOIC-14_L8.7-W3.9-P1.27-LS6.0-BL
  oval 0.574x2.038 smd: 1(-3.81,-2.769) 2(-2.54,-2.769) 3(-1.27,-2.769) 4(0,-2.769) 5(1.27,-2.769) 6(2.54,-2.769) 7(3.81,-2.769) 8(3.81,2.769) 9(2.54,2.769) 10(1.27,2.769) 11(0,2.769) 12(-1.27,2.769) 13(-2.54,2.769) 14(-3.81,2.769)
SOT-23-3_L2.9-W1.6-P1.90-LS2.8-BR
  rect 1.07x0.6 smd: 1(1.235,-0.95) 2(1.235,0.95) 3(-1.235,0)
SOT-23-6_L2.9-W1.6-P0.95-LS2.8-BL
  rect 0.532x1.072 smd: 1(-0.95,-1.149) 2(0,-1.149) 3(0.95,-1.149) 4(0.95,1.149) 5(0,1.149) 6(-0.95,1.149)
TSSOP-20_L6.5-W4.4-P0.65-LS6.4-BL
  oval 0.364x1.742 smd: 1(-2.925,-2.871) 2(-2.275,-2.871) 3(-1.625,-2.871) 4(-0.975,-2.871) 5(-0.325,-2.871) 6(0.325,-2.871) 7(0.975,-2.871) 8(1.625,-2.871) 9(2.275,-2.871) 10(2.925,-2.871) 11(2.925,2.871) 12(2.275,2.871) 13(1.625,2.871) 14(0.975,2.871) 15(0.325,2.871) 16(-0.325,2.871) 17(-0.975,2.871) 18(-1.625,2.871) 19(-2.275,2.871) 20(-2.925,2.871)
触点
  round 1 smd: 1(0,0)

## Nets
As in the schematic, except:
GND: C4.1 C5.1 C6.1 C9.2 C10.2 C12.1 C16.1 C17.1 C18.1 C19.1 C20.1 C21.1 C22.2 C23.1 C24.2 C26.2 C27.2 C28.2 C30.2 C31.2 C32.1 CN1.2 D10.2 LED1.1 NOREF#4.2 NOREF#7.2 NOREF#8.2 Q4.1 Q4.2 Q4.3 Q5.1 Q5.2 Q5.3 Q6.1 Q6.2 Q6.3 R4.2 R11.1 R16.1 R17.1 R18.1 R19.1 R28.1 U1.1 U3.8 U4.8 U4.23 U4.35 U4.47 U5.12 U9.1 U10.1
VCC12V: C4.2 C5.2 C6.2 C12.2 C24.1 C26.1 C27.1 C28.1 C30.1 C31.1 C32.2 D1.2 D2.2 D3.2 D10.1 NOREF#11.2 NOREF#13.2 Q1.5 Q1.6 Q1.7 Q1.8 Q1.9 Q2.5 Q2.6 Q2.7 Q2.8 Q2.9 Q3.5 Q3.6 Q3.7 Q3.8 Q3.9 R1.1 U1.3 U3.7 U5.3
MID: C13.2 C14.2 C15.2 NOREF#6.2 R9.2 R13.2 R15.2 U5.4 U5.6 U5.8
U: C3.1 NOREF#5.2 NOREF#9.2 Q1.1 Q1.2 Q1.3 Q4.5 Q4.6 Q4.7 Q4.8 Q4.9 R8.1 U3.18
V: C8.1 NOREF.2 NOREF#2.2 Q2.1 Q2.2 Q2.3 Q5.5 Q5.6 Q5.7 Q5.8 Q5.9 R12.1 U3.15
W: C11.1 NOREF#10.2 NOREF#12.2 Q3.1 Q3.2 Q3.3 Q6.5 Q6.6 Q6.7 Q6.8 Q6.9 R14.1 U3.12
WW: C15.1 NOREF#3.TP1 R14.2 R15.1 R16.2 U5.9

Pads without a net: U4 1 2 3 4 10 11 12 13 14 15 16 17 18 19 32 33 38 39 40 41 43 45 46; U5 10 11 13; X1 2 4

## Via types
v1: diameter 0.61, hole 0.305, Top Layer to Bottom Layer, 156 vias

## Routing (per net, layer and track width the routed paths; a pad name or vN(x,y) marks a point on that pad's centre or on a via; arc(x,y) is an arc through that point)
GND: length 88.9
  Top Layer w0.254: R19.1 18.44,14.07 v1(17.82,13.45) 17.84,13.43 C20.1 17.84,11.62 17.32,11.1 13.54,11.1 13.32,11.31 U4.8 ; 19.05,24.15 19.05,25.27 18.41,25.91 18.41,31.11 18.16,31.37 v1(17.72,31.37) ; v1(0.76,12.71) U9.1 ; v1(17.81,21.82) 16.85,21.82 C19.1 16.13,21.84 15.78,21.5 15.78,19.27 16.04,19.01 U4.23 ; v1(6.71,14.21) 6.98,14.48 8.29,14.48 U4.47 ; v1(6.71,14.21) 6.71,13.61 6.94,13.38 6.94,12.14 6.77,11.98 v1(6.22,11.98) 6.22,10.93 6.47,10.68 LED1.1 ; v1(6.71,14.21) 6.6,14.21 ; v1(22.48,41.91) NOREF#8.2 ; v1(7.1,17.42) R28.1 ; R17.1 5.97,29.24 5.97,28.7 5.72,28.45 ; C16.1 9.71,5.4 v1(9.78,5.33) v1(10.83,5.33) v1(11.98,5.33) v1(13,5.33) v1(14.09,5.33) 14.23,5.47 C17.1 ; v1(1.65,29.21) 1.68,29.24 R16.1 2.75,28.62 2.92,28.45 5.72,28.45 ; v1(6.03,21.48) 6.1,21.48 6.5,21.08 C21.1 7.05,21.91 7.37,22.22 10.03,22.22 10.32,21.93 U4.35 ; 5.72,28.45 9.14,28.45 9.27,28.57 R18.1
  Bottom Layer w0.254: v1(2.52,9.32) 2.86,9.65 R4.2 ; U3.8 4.85,23.27 4.44,22.86 4.44,22.48 4.19,22.22 C12.1 v1(1.74,22.22) ; v1(10.03,19.4) 9.87,19.56 C22.2
  Bottom Layer w0.508: U1.1 9.41,10.09 10.62,10.09 11.05,9.66 11.05,9.08 C6.1 11.24,9.02 12.68,9.02 C5.1 C4.1 16.14,8.75 v1(16.38,8.51) ; C10.2 C9.2
  vias: v1(1.18,42.16) v1(1.27,33.15) v1(1.91,42.16) v1(1.91,33.15) v1(2.79,35.18) v1(2.79,34.54) v1(2.79,33.91) v1(3.05,17.14) v1(3.62,35.18) v1(3.62,34.54) v1(3.62,33.91) v1(3.89,17.13) v1(4.44,35.18) v1(4.44,34.54) v1(4.44,33.91) v1(7.37,42.22) v1(8.17,42.22) v1(8.51,35.18) v1(8.51,34.54) v1(8.51,33.92) v1(8.89,3.17) v1(8.89,2.47) v1(8.89,1.77) v1(8.89,1.07) v1(9.59,3.17) v1(9.59,2.47) v1(9.59,1.77) v1(9.59,1.07) v1(9.65,35.18) v1(9.65,34.54) v1(9.65,33.91) v1(10.29,3.17) v1(10.29,2.47) v1(10.29,1.77) v1(10.29,1.07) v1(10.67,35.18) v1(10.67,34.54) v1(10.67,33.91) v1(10.99,3.17) v1(10.99,2.47) v1(10.99,1.77) v1(10.99,1.07) v1(11.69,3.17) v1(11.69,2.47) v1(11.69,1.77) v1(11.69,1.07) v1(13.46,42.22) v1(14.23,42.22) v1(14.48,35.18) v1(14.48,34.54) v1(14.48,33.87) v1(15.62,35.18) v1(15.62,34.54) v1(15.62,33.91) v1(16.62,34.54) v1(16.64,35.18) v1(16.62,33.91) v1(20.06,41.91) v1(20.88,41.91) v1(21.68,41.91)
VCC3V3: length 31.3
  Top Layer w0.254: v1(6.07,20.68) 6.41,20.34 8.25,20.34 8.45,20.53 C21.2 9.75,21.08 U4.36 ; R7.2 19.31,20.71 19.07,20.46 v1(17.73,20.46) 16.85,20.46 C19.2 16.83,19.52 U4.24 ; R10.2 17.77,10.57 v1(17.69,10.65) 19.54,10.65 20.07,11.18 R6.2 R5.2 ; U4.48 8.25,13.95 v1(8.25,12.7) ; v1(3.63,20.57) 2.27,20.57 U6.1 ; U4.9 13.82,11.74 14.07,11.48 16.18,11.48 16.44,11.75 C20.2 16.44,13.31 v1(16.51,13.37) ; R2.1 4.94,14.12 v1(3.33,14.12)
  Bottom Layer w0.254: C23.2 3.55,19.75 4.99,19.75
  vias: v1(4.54,20.53) v1(6.21,19.05)
VCC5V: length 19
  Bottom Layer w0.254: C9.1 4.17,15.99 3.94,15.75 3.94,11.18 R3.2
  Bottom Layer w0.508: L1.2 11,17.35 9.64,15.99 C10.1 ; C10.1 8.64,17.02 8.95,17.33 C22.1 7.75,18.16 7.46,18.45 U10.3 ; C10.1 C9.1
VCC12V: length 42.7
  Top Layer w0.254: v1(19.04,31.37) 19.05,31.36 19.05,29.69
  Bottom Layer w0.254: C27.1 0.62,36.31 0.51,36.19 0.51,21.72 1.02,21.21 4.95,21.21 5.14,21.4 C12.2 5.14,22.8 5.5,23.15 5.5,24.31 ; R1.1 9.01,7.48 9.4,7.88 U1.3
  Bottom Layer w0.381: 16.12,2.42 16.12,2.85 16.25,2.98 ; 16.12,2.42 16.25,2.55 ; 16.12,2.42 16.12,2.09 ; v1(17.08,3.11) v1(17.78,3.11) v1(18.48,3.11)
  Bottom Layer w0.508: U1.3 9.97,8.19 10.61,7.55 C6.2 11.15,7.53 11.15,7.01 11.41,6.75 C5.2 C4.2 16.75,6.75 17.14,6.35 17.14,2.99 ; 17.14,2.99 17.27,3.11 ; 17.14,2.99 NOREF#11.2
  vias: v1(15.68,3.11) v1(15.68,2.41) v1(15.68,1.71) v1(15.68,1.01) v1(16.38,3.11) v1(16.38,2.41) v1(16.38,1.71) v1(16.38,1.01) v1(17.08,2.41) v1(17.08,1.71) v1(17.08,1.01) v1(17.78,2.41) v1(17.78,1.71) v1(17.78,1.01) v1(18.48,2.41) v1(18.48,1.71) v1(18.48,1.01)
BOOT0: length 1.7
  Top Layer w0.254: R11.2 7.23,15.74 7.5,16.01 U4.44
BOOT1: length 2.2
  Top Layer w0.254: U4.20 18.19,17.51 18.44,17.26 R19.2
HIN_U: length 7.1
  Top Layer w0.254: U4.29 13.32,21.77 13.78,22.22 v1(14,22.22)
  Bottom Layer w0.254: v1(14,22.22) 12.86,23.37 10.79,23.37 9.86,24.31 9.4,24.31
HIN_V: length 6.9
  Top Layer w0.254: v1(12.95,22.22) 12.95,21.97 12.82,21.84 U4.30
  Bottom Layer w0.254: U3.2 8.75,23.38 9.27,22.86 12.42,22.86 13,22.27
HIN_W: length 6.9
  Top Layer w0.254: v1(11.98,22.27) 12.02,22.27 12.32,21.97 U4.31
  Bottom Layer w0.254: U3.3 8.1,23.14 9.02,22.22 11.93,22.22 v1(11.98,22.27)
HO1: length 12.1
  Bottom Layer w0.254: R20.1 18.26,33.27 17.27,33.27 17.09,33.09 17.09,31.82 16.76,31.5 9.4,31.5 8.75,30.85 U3.19
HO2: length 8.4
  Bottom Layer w0.254: U3.16 6.8,31.69 7.43,32.33 12.28,32.33 12.41,32.45 R21.1
HO3: length 4.2
  Bottom Layer w0.254: U3.13 4.85,31.78 5.21,32.13 6.1,32.13 6.32,32.35 R22.1
LIN_U: length 13.2
  Top Layer w0.254: U4.26 14.82,19.39 14.48,19.05 13.21,19.05 v1(13.18,19.02)
  Bottom Layer w0.254: v1(13.18,19.02) 13.18,20.73 12.22,21.69 8.54,21.69 7.45,22.77 U3.4
LIN_V: length 12.9
  Top Layer w0.254: v1(12.29,19.26) 12.63,19.6 14.02,19.6 14.32,19.91 U4.27
  Bottom Layer w0.254: v1(12.29,19.26) 12.29,20.73 11.94,21.08 8.25,21.08 6.8,22.53 U3.5
LIN_W: length 12
  Top Layer w0.254: U4.28 13.84,20.99 13.84,20.19 13.62,19.97 11.79,19.97 v1(11.58,19.76)
  Bottom Layer w0.254: U3.6 6.15,22.3 8,20.45 11.3,20.45 11.58,20.17 v1(11.58,19.76)
LO1: length 14.7
  Top Layer w0.254: v1(7.73,31.49) 7.67,31.43 v1(3.94,31.43)
  Bottom Layer w0.254: v1(16.02,32.88) 16.02,32.22 15.67,31.88 8.12,31.88 v1(7.73,31.49) ; v1(3.94,31.43) 3.75,31.43 3.55,31.24 U3.11
LO2: length 16.4
  Bottom Layer w0.254: v1(10.1,32.91) 7.6,32.91 7.37,33.15 7.37,33.65 7.11,33.91 5.46,33.91 2.92,31.37 2.92,25.78 3.56,25.15 3.56,24.35 3.47,24.26 ; 3.53,24.23 3.58,24.28
LO3: length 12.4
  Bottom Layer w0.254: U3.9 4.2,23.41 3.95,23.16 2.62,23.16 2.29,23.49 2.29,32.17 v1(2.76,32.64)
MID: length 24.8
  Top Layer w0.254: NOREF#6.2 C15.2 C14.2 6.02,24.77 R13.2 7.55,24.83 C13.2 9.32,24.77 R9.2 12.31,24.77 12.93,24.15 U5.8 13.97,25.15 13.33,25.78 13.33,27.94 13.79,28.39 14.96,28.39 15.22,28.65 15.22,29.67 U5.6 15.24,28.65 15.49,28.39 17.53,28.39 17.78,28.65 U5.4
MOTOR: length 16.4
  Top Layer w0.254: CN1.1 2.69,8.66 2.92,8.89 8.25,8.89 8.64,9.27 8.64,11.18 9.4,11.94 9.4,16.76 9.15,17.01 U4.42
OSC_IN: length 7.7
  Top Layer w0.254: U4.5 11.82,11.19 11.11,10.48 C16.2 11.68,10.03 11.94,9.78 11.94,6.98 11.6,6.64 X1.3
OSC_OUT: length 4.5
  Top Layer w0.254: X1.1 13.04,9.06 12.83,9.27 12.83,10.01 ; U4.6 12.32,11.04 12.83,10.54 C17.2
RESET: length 5.8
  Top Layer w0.254: R10.1 16.26,10.49 16.01,10.74 13.26,10.74 12.82,11.18 U4.7
SWCLK: length 9.8
  Top Layer w0.254: U8.1 2.04,15.24 4.44,15.24 4.77,15.57 R28.2 4.77,17.85 5.08,18.16 6.98,18.16 7.24,18.41 7.24,19.13 7.62,19.51 U4.37
SWDIO: length 11
  Top Layer w0.254: U4.34 10.82,20.22 10.59,19.98 5,19.98 4.71,19.69 R29.2 3.28,19.05 U7.1
U: length 38.1
  Top Layer w0.254: 10.81,29.24 10.85,29.21 11.43,29.21 11.65,29.43 v1(11.65,30.05) 13.74,32.13 19.18,32.13 19.69,32.64 19.69,41.27 19.3,41.66 v1(17.44,41.66)
  Bottom Layer w0.254: U3.18 8.13,30.02 8.13,29.08 8.51,28.7 C3.1 11.18,28.64 11.18,28.19 11.4,27.97 12.45,27.97 12.73,27.69 15.88,27.69 16.13,27.94 16.13,29.72 15.8,30.05 v1(11.65,30.05)
  vias: v1(15.84,42.46) v1(15.84,41.66) v1(15.84,40.86) v1(16.64,42.46) v1(16.64,41.66) v1(16.64,40.86) v1(17.44,42.46) v1(17.44,40.86)
UOUT: length 23.3
  Top Layer w0.254: U4.21 21.14,18.01 21.34,18.21 R5.1 22.6,18.79 22.99,19.18 22.99,31.11 22.61,31.5 20.7,31.5 20.32,31.11 U5.2
UU: length 13.8
  Top Layer w0.254: R18.2 10.77,27.69 10.81,27.73 ; 10.81,27.73 10.81,26.3 R9.1 9.32,26.28 C13.1 ; 10.81,27.73 11.86,27.73 12.19,28.07 12.19,29.72 13.59,31.11 16.13,31.11 16.51,30.73 U5.5
V: length 42.8
  Top Layer w0.254: R12.1 7.49,29.84 7.85,30.2 10.79,30.2 v1(10.89,30.3) 13.33,32.75 13.33,41.4 13.08,41.66 v1(11.43,41.66)
  Bottom Layer w0.254: v1(10.89,30.3) 11.22,30.63 15.98,30.63 16.64,29.97 16.64,26.16 16.13,25.65 12.29,25.65 11.94,26 11.94,26.41 11.7,26.66 C8.1 6.62,26.66 6.15,27.12 U3.15
  vias: v1(9.83,42.46) v1(9.83,41.66) v1(9.83,40.86) v1(10.63,42.46) v1(10.63,41.66) v1(10.63,40.86) v1(11.43,42.46) v1(11.43,40.86)
VB1: length 6.8
  Bottom Layer w0.254: 9.4,30.05 9.4,29.46 12.38,29.46 12.64,29.21 C3.2 D1.1
VB2: length 10.5
  Bottom Layer w0.254: D2.1 15.01,26.66 C8.2 12.62,27.25 12.32,27.56 8,27.56 7.49,28.07 7.49,30.01 U3.17
VB3: length 14.3
  Bottom Layer w0.254: 5.5,30.05 5.46,30.01 5.46,26.42 5.97,25.91 11.3,25.91 11.92,25.29 11.92,24.76 12.04,24.64 C11.2 D3.1
VOUT: length 16.8
  Top Layer w0.254: U4.22 18.13,18.51 18.54,18.92 19.93,18.92 R6.1 20.07,19.68 20.32,19.94 21.84,19.94 22.35,20.45 22.35,29.44 22.1,29.69 U5.1
VV: length 16.9
  Top Layer w0.254: C14.1 6.02,26.28 R13.1 ; U5.7 13.31,29.69 12.83,29.21 12.83,25.91 12.45,25.53 8.64,25.53 8.38,25.78 8.38,27.43 8.12,27.69 R12.2 ; 7.29,26.09 7.3,26.09 7.48,26.27 ; 7.48,26.27 7.48,26.17 ; 7.48,26.27 R13.1 ; R13.1 R12.2 ; R12.2 6.01,27.69 R17.2
W: length 53.5
  Top Layer w0.254: v1(5.16,41.62) 5.63,41.15 6.73,41.15 6.98,40.89 6.98,32.77 7.68,32.07 8.95,32.07 v1(10.24,30.78) 4.75,30.78 4.28,30.32 R14.1
  Bottom Layer w0.254: 4.17,26.31 4.17,26.06 4.77,25.46 9.72,25.46 10.54,24.64 C11.1 11.24,24.1 11.46,23.88 13.33,23.88 13.59,23.62 16.64,23.62 17.02,24 17.02,30.48 16.45,31.04 10.8,31.04 10.55,30.78 v1(10.24,30.78) ; 4.17,26.31 4.16,26.32 ; 4.17,26.31 4.17,30.01 U3.12
  vias: v1(3.56,42.42) v1(3.56,41.62) v1(3.56,40.82) v1(4.36,42.42) v1(4.36,41.62) v1(4.36,40.82) v1(5.16,42.42) v1(5.16,40.82)
WOUT: length 10.6
  Top Layer w0.254: U4.25 15.32,22.18 15.66,22.52 19.89,22.52 20.07,22.34 20.07,21.72 20.32,21.46 R7.1 20.82,22.34 21.59,23.11 U5.14
WW: length 24.7
  Top Layer w0.254: 2.79,26.29 C15.1 ; 2.79,26.29 2.03,26.29 1.65,25.91 1.65,23.24 2.03,22.86 14.86,22.86 15.24,23.24 U5.9 ; 2.79,26.29 4.32,26.29 ; NOREF#3.TP1 1.57,27.73 R16.2 2.75,27.74 4.27,27.74 R14.2 4.32,27.7 4.32,26.29 ; 4.32,26.29 R15.1 ; 4.32,26.29 4.25,26.36
$1N830: length 1.9
  Top Layer w0.254: 4.96,12.59 5.02,12.53 LED1.2
$1N838: length 3.6
  Bottom Layer w0.254: R1.2 7.87,6.86 8.13,7.11 8.13,8.76 7.75,9.14 U1.5
$1N841: length 1.5
  Bottom Layer w0.254: C1.1 7.3,10.29 U1.6
$1N842: length 7.9
  Bottom Layer w0.381: U1.2 8.76,9.14 8.51,9.4 8.51,10.67 8.7,10.86 C1.2
  Bottom Layer w0.508: C1.2 12.75,11.56 L1.1
$1N843: length 4
  Bottom Layer w0.254: R3.1 R4.1 5.58,8.9 6.28,8.19 U1.4
$1N6581: length 7.6
  Top Layer w0.254: v1(18.28,34.8) 18.8,35.31 v1(18.8,40.13)
  Bottom Layer w0.254: v1(18.8,40.13) 18.8,39.5 18.29,38.99 17.63,38.99 Q1.4
$1N6585: length 7.4
  Top Layer w0.254: v1(12.62,40.13) 12.62,35.05 v1(12.41,34.84)
  Bottom Layer w0.254: v1(12.62,40.13) 12.62,39.29 12.32,38.99 11.67,38.99 Q2.4
$1N6698: length 7.2
  Top Layer w0.254: v1(6.19,34.71) 6.27,34.8 v1(6.27,40)
  Bottom Layer w0.254: Q3.4 5.33,38.99 6.1,38.99 6.27,39.17 v1(6.27,40)
$1N6700: length 3.2
  Top Layer w0.254: Q5.4 11.66,36.09 R26.2
$1N6702: length 4.3
  Top Layer w0.254: Q6.4 5.26,32.82 5.08,32.64 R27.2
$1N6741: length 3.3
  Top Layer w0.254: Q4.4 17.62,32.99 R25.2

## Copper pours and planes (outline as drawn; the poured copper is in the pictures)
GND on Top Layer: 7.76,36.62 11.3,36.62 11.3,33.53 7.76,33.53
GND on Top Layer: 17.91,8.64 22.35,8.64 22.35,4.19 17.91,4.19
GND on Top Layer: 1.66,36.61 4.83,36.61 4.83,33.4 1.66,33.4
GND on Top Layer: 13.81,36.62 17.27,36.62 17.27,33.53 13.81,33.53
GND on Bottom Layer: 0.76,42.54 2.29,42.54 2.29,40.26 0.76,40.26
GND on Bottom Layer: 6.98,42.62 8.52,42.62 8.52,40.22 6.98,40.22
GND on Bottom Layer: 0.89,35.09 2.35,35.09 2.35,32.64 0.89,32.64
GND on Bottom Layer: 13.08,42.67 14.6,42.67 14.6,40.39 13.08,40.39
GND on Bottom Layer: 19.43,42.29 22.99,42.29 22.99,40 19.43,40
GND on Bottom Layer: 2.67,18.54 5.55,18.54 5.55,16.64 2.67,16.64
GND on Inner1: 0.26,43.18 23.37,43.18 23.37,0.26 0.26,0.26
VCC3V3 on Bottom Layer: 2.78,20.95 5.59,20.95 5.59,19.14 2.78,19.14
VCC3V3 on Inner2: 1.27,21.24 18.14,21.24 18.14,9.78 1.27,9.78
VCC12V on Bottom Layer: 13.21,38.1 17.91,38.1 17.91,35.69 13.21,35.69
VCC12V on Bottom Layer: 18.41,3.56 15.11,3.56 15.11,0.4 23.5,0.4 23.5,39.62 0.63,39.62 0.63,35.61 18.41,35.55
VCC12V on Bottom Layer: 6.98,38.1 11.94,38.1 11.94,35.56 6.98,35.56
VCC12V on Bottom Layer: 0.63,38 5.59,38 5.59,35.56 0.63,35.56
U on Top Layer: 15.11,43.05 18.16,43.05 18.16,37 15.11,37
U on Bottom Layer: 15.08,43.05 18.16,43.05 18.16,38.36 15.08,38.36
V on Top Layer: 9.14,43.05 12.19,43.05 12.19,37 9.14,37
V on Bottom Layer: 9.13,43.11 12.21,43.11 12.21,38.42 9.13,38.42
W on Top Layer: 2.79,43.05 5.84,43.05 5.84,37 2.79,37
W on Bottom Layer: 2.78,43.11 5.86,43.11 5.86,38.42 2.78,38.42

Small or netless copper shapes (teardrops, artwork), in the pictures only: 4 on Inner1
